# Altium project Custom_ESC.PrjPcb
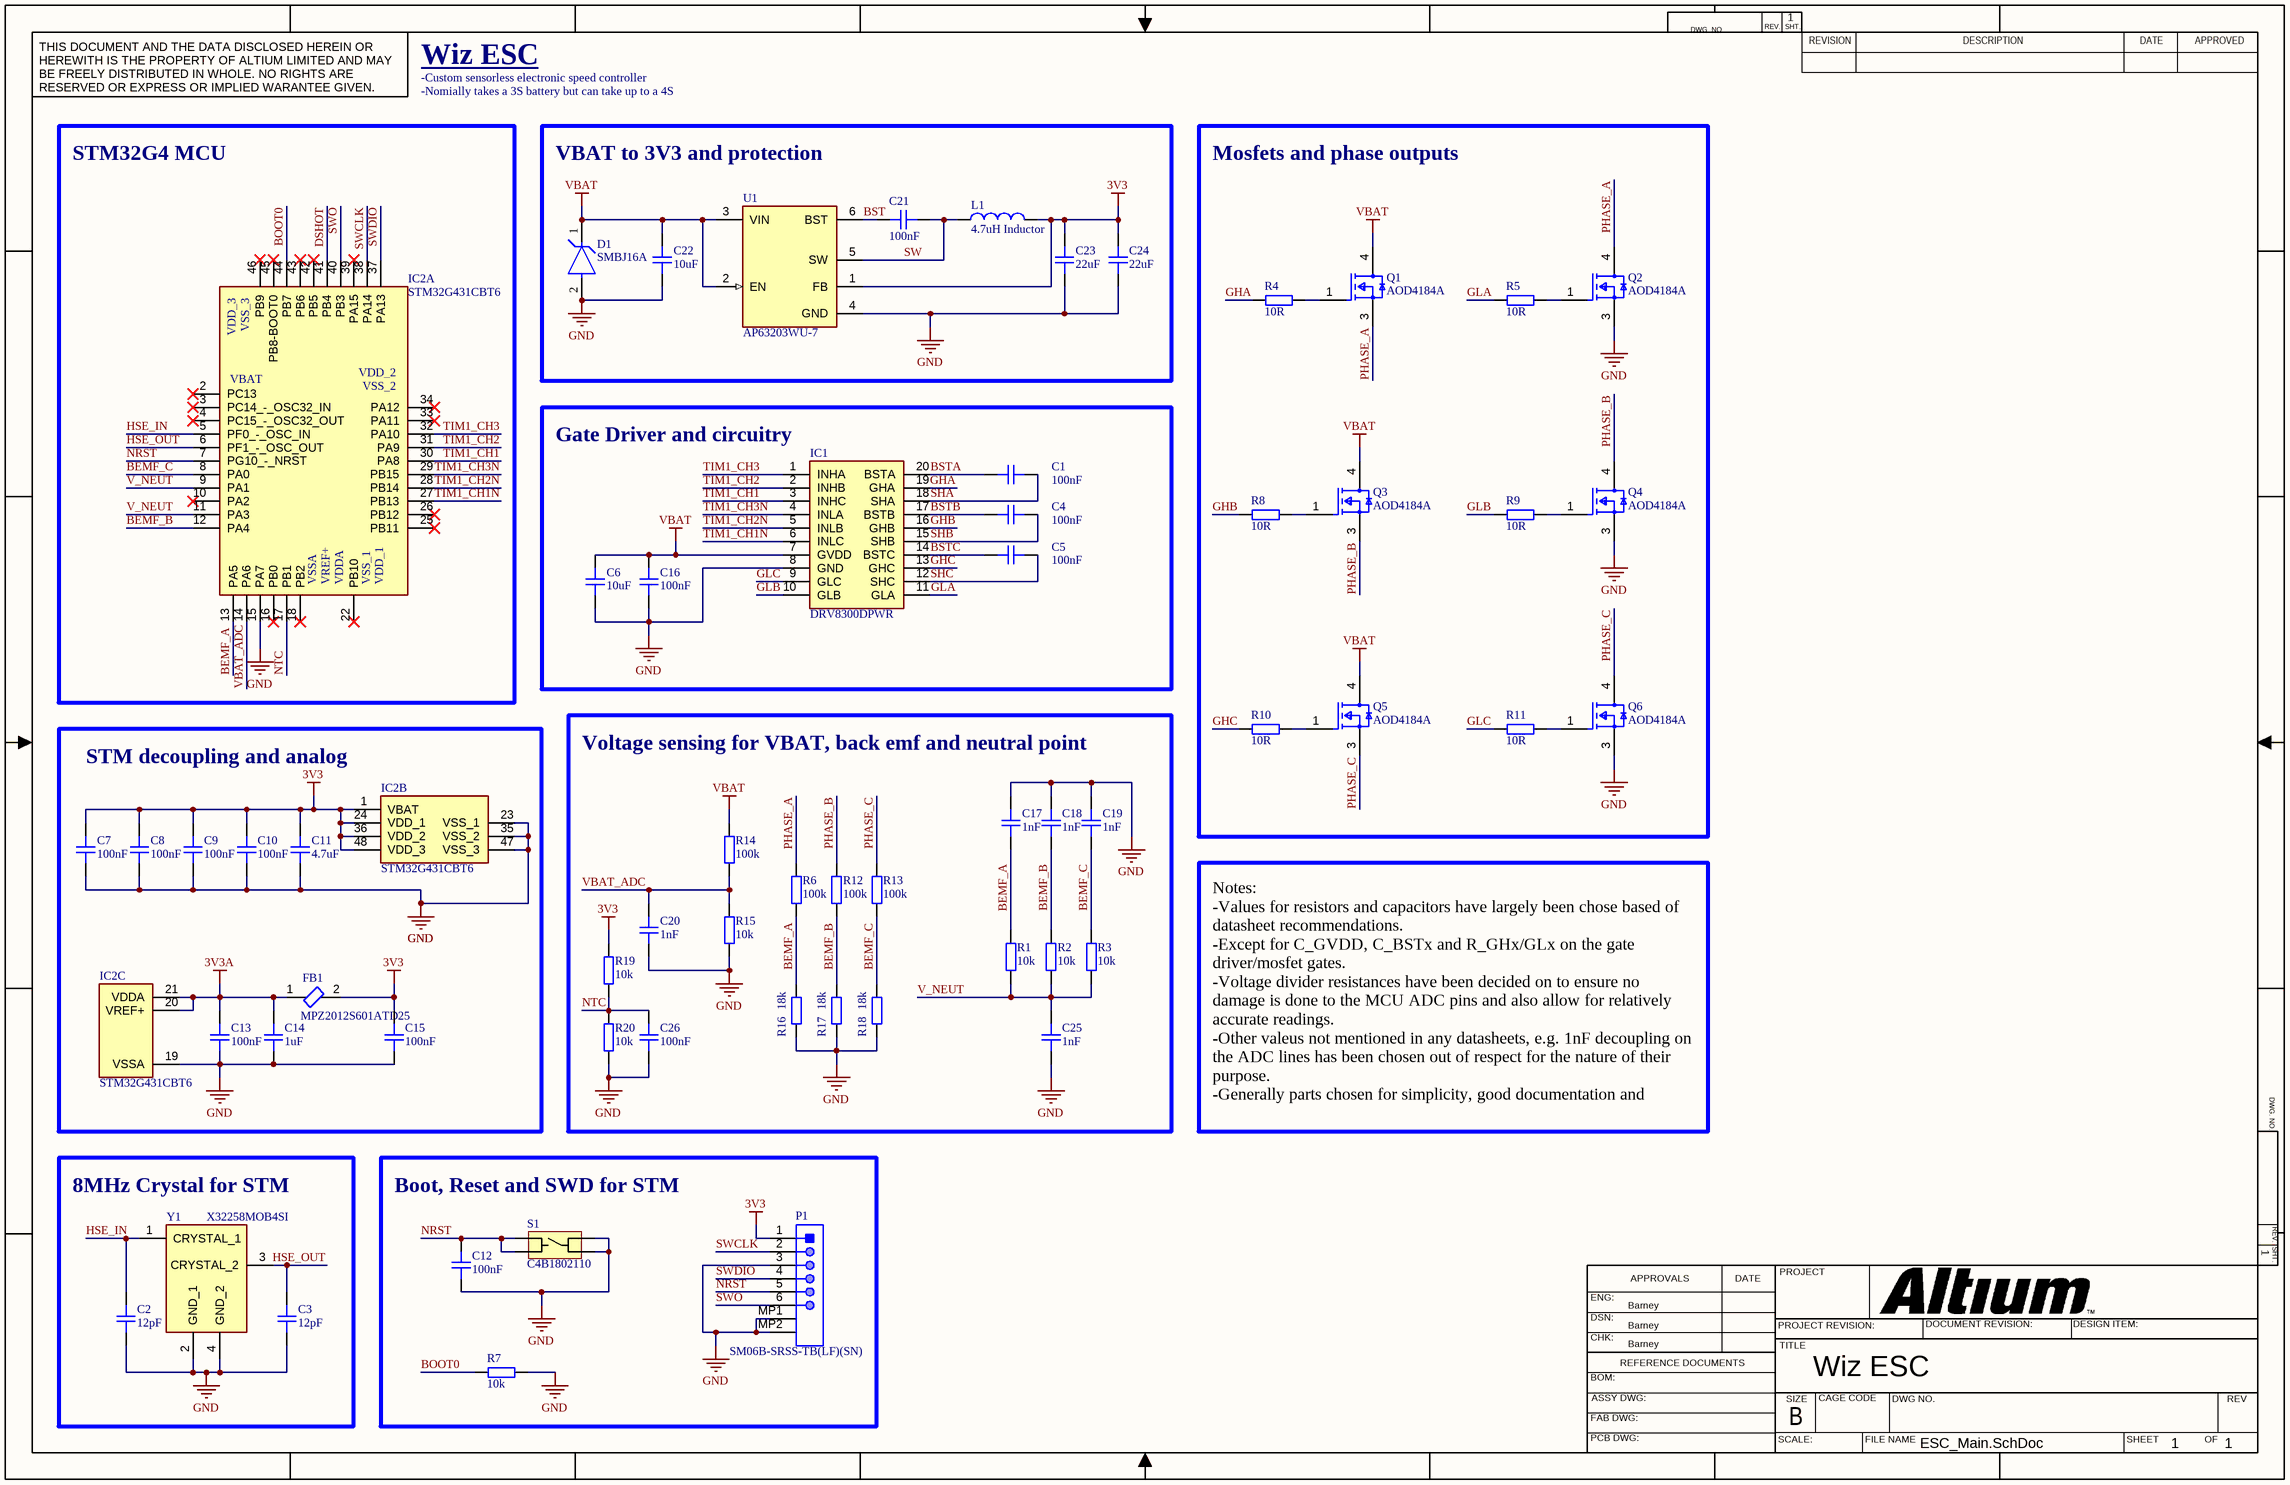
[diagram p0: ESC_Main.SchDoc]
1 sheet, 61 parts. Net scope: global (net labels, ports and power ports of the same name join across sheets).

## Sheet ESC_Main.SchDoc: Wiz ESC
size 431 x 279 mm; Date: 16/7/2026; ApprovedBy: Barney; CheckedBy: Barney; Author: Barney; CompanyName: WizTech; DrawnBy: Barney; Engineer: Barney; Organization: WizTech; DocumentNumber: 1; Revision: 1; SheetNumber: 1; SheetTotal: 1; Time: 21:10; ImagePath: feef; Application_BuildNumber: 1

### Parts
C1  100nF  [CAP_0402]
C2  12pF  [CAP_0402]
C3  12pF  [CAP_0402]
C4  100nF  [CAP_0402]
C5  100nF  [CAP_0402]
C6  10uF  [CAP_1206]
C7  100nF  [CAP_0402]
C8  100nF  [CAP_0402]
C9  100nF  [CAP_0402]
C10  100nF  [CAP_0402]
C11  4.7uF  [CAP_0402]
C12  100nF  [CAP_0402]
C13  100nF  [CAP_0402]
C14  1uF  [CAP_0402]
C15  100nF  [CAP_0402]
C16  100nF  [CAP_0402]
C17  1nF  [CAP_0402]
C18  1nF  [CAP_0402]
C19  1nF  [CAP_0402]
C20  1nF  [CAP_0402]
C21  100nF  [CAP_0402]
C22  10uF  [CAP_1206]
C23  22uF  [CAP_0402]
C24  22uF  [CAP_0402]
C25  1nF  [CAP_0402]
C26  100nF  [CAP_0402]
D1  SMBJ16A  [FP-DO-214AA-MFG]
FB1  MPZ2012S601ATD25  [BEADC2112X105N]
IC1  DRV8300DPWR  [SOP65P640X120-20N]
IC2  STM32G431CBT6  [QFP50P900X900X160-48N]  (parts A,B,C of 3)
L1  4.7uH Inductor  [SMD 8x8 Inductor]
P1  SM06B-SRSS-TB(LF)(SN)  [JST-SM06B-SRSS-TB_V]
Q1  AOD4184A  [FP-TO252-MFG]
Q2  AOD4184A  [FP-TO252-MFG]
Q3  AOD4184A  [FP-TO252-MFG]
Q4  AOD4184A  [FP-TO252-MFG]
Q5  AOD4184A  [FP-TO252-MFG]
Q6  AOD4184A  [FP-TO252-MFG]
R1  10k  [RES_0402]
R2  10k  [RES_0402]
R3  10k  [RES_0402]
R4  10R  [RES_0402]
R5  10R  [RES_0402]
R6  100k  [RES_0603]
R7  10k  [RES_0402]
R8  10R  [RES_0402]
R9  10R  [RES_0402]
R10  10R  [RES_0402]
R11  10R  [RES_0402]
R12  100k  [RES_0603]
R13  100k  [RES_0603]
R14  100k  [RES_0603]
R15  10k  [RES_0603]
R16  18k  [RES_0603]
R17  18k  [RES_0603]
R18  18k  [RES_0603]
R19  10k  [RES_0402]
R20  10k  [RES_0402]
S1  C4B1802110  [SW-SMD_4P-L3.5-W3.0-P1.50-LS4.7]
U1  AP63203WU-7  [FP-TSOT26-MFG]
Y1  X32258MOB4SI  [X32258MOB4SI]

### Blocks framed on the sheet
STM32G4 MCU: IC2
VBAT to 3V3 and protection: C21-C24 D1 L1 U1
Mosfets and phase outputs: Q1-Q6 R4 R5 R8-R11
Gate Driver and circuitry: C1 C4-C6 C16 IC1
STM decoupling and analog: C7-C11 C13-C15 FB1 IC2
Voltage sensing for VBAT, back emf and neutral point: C17-C20 C25 C26 R1-R3 R6 R12-R20
8MHz Crystal for STM: C2 C3 Y1
Boot, Reset and SWD for STM: C12 P1 R7 S1

### Nets
3V3: C7.1 C8.1 C9.1 C10.1 C11.1 C15.1 C23.2 C24.2 FB1.2 IC2.1(VBAT) IC2.24(VDD_1) IC2.36(VDD_2) IC2.48(VDD_3) L1.2 P1.1 R19.2 U1.1(FB)
3V3A: C13.1 C14.2 FB1.1 IC2.20(VREF+) IC2.21(VDDA)
GND: C2.2 C3.2 C6.1 C7.2 C8.2 C9.2 C10.2 C11.2 C12.2 C13.2 C14.1 C15.2 C16.1 C17.1 C18.1 C19.1 C20.2 C22.1 C23.1 C24.1 C25.2 C26.1 D1.2(A) IC1.8(GND) IC2.15(PA7) IC2.19(VSSA) IC2.23(VSS_1) IC2.35(VSS_2) IC2.47(VSS_3) P1.3 P1.MP1 P1.MP2 Q2.3(S) Q4.3(S) Q6.3(S) R7.2 R15.1 R16.1 R17.1 R18.1 R20.1 S1.3 S1.4 U1.4(GND) Y1.2(GND_1) Y1.4(GND_2)
VBAT: C6.2 C16.2 C22.2 D1.1(C) IC1.7(GVDD) Q1.4(D) Q3.4(D) Q5.4(D) R14.2 U1.2(EN) U1.3(VIN)
BEMF_A: C17.2 IC2.13(PA5) R1.2 R6.1 R16.2
BEMF_B: C18.2 IC2.12(PA4) R2.2 R12.1 R17.2
BEMF_C: C19.2 IC2.8(PA0) R3.2 R13.1 R18.2
BOOT0: IC2.44(PB7) R7.1
BST: C21.2 U1.6(BST)
BSTA: C1.2 IC1.20(BSTA)
BSTB: C4.2 IC1.17(BSTB)
BSTC: C5.2 IC1.14(BSTC)
DSHOT: IC2.41(PB4)
GHA: IC1.19(GHA) R4.1
GHB: IC1.16(GHB) R8.1
GHC: IC1.13(GHC) R10.1
GLA: IC1.11(GLA) R5.1
GLB: IC1.10(GLB) R9.1
GLC: IC1.9(GLC) R11.1
HSE_IN: C2.1 IC2.5(PF0_-_OSC_IN) Y1.1(CRYSTAL_1)
HSE_OUT: C3.1 IC2.6(PF1_-_OSC_OUT) Y1.3(CRYSTAL_2)
NRST: C12.1 IC2.7(PG10_-_NRST) P1.5 S1.1 S1.2
NTC: C26.2 IC2.17(PB1) R19.1 R20.2
PHASE_A: Q1.3(S) Q2.4(D) R6.2
PHASE_B: Q3.3(S) Q4.4(D) R12.2
PHASE_C: Q5.3(S) Q6.4(D) R13.2
SHA: C1.1 IC1.18(SHA)
SHB: C4.1 IC1.15(SHB)
SHC: C5.1 IC1.12(SHC)
SW: C21.1 L1.1 U1.5(SW)
SWCLK: IC2.38(PA14) P1.2
SWDIO: IC2.37(PA13) P1.4
SWO: IC2.40(PB3) P1.6
TIM1_CH1: IC1.3(INHC) IC2.30(PA8)
TIM1_CH1N: IC1.6(INLC) IC2.27(PB13)
TIM1_CH2: IC1.2(INHB) IC2.31(PA9)
TIM1_CH2N: IC1.5(INLB) IC2.28(PB14)
TIM1_CH3: IC1.1(INHA) IC2.32(PA10)
TIM1_CH3N: IC1.4(INLA) IC2.29(PB15)
V_NEUT: C25.1 IC2.9(PA1) IC2.11(PA3) R1.1 R2.1 R3.1
VBAT_ADC: C20.1 IC2.14(PA6) R14.1 R15.2
NetQ1_1: Q1.1(G) R4.2
NetQ2_1: Q2.1(G) R5.2
NetQ3_1: Q3.1(G) R8.2
NetQ4_1: Q4.1(G) R9.2
NetQ5_1: Q5.1(G) R10.2
NetQ6_1: Q6.1(G) R11.2

Not connected (* = marked no-connect by the designer): IC2 2(PC13)* 3(PC14_-_OSC32_IN)* 4(PC15_-_OSC32_OUT)* 10(PA2)* 16(PB0)* 18(PB2)* 22(PB10)* 25(PB11)* 26(PB12)* 33(PA11)* 34(PA12)* 39(PA15)* 42(PB5)* 43(PB6)* 45(PB8-BOOT0)* 46(PB9)*

### Notes on the sheet
- Wiz ESC
- -Custom sensorless electronic speed controller
- -Nomially takes a 3S battery but can take up to a 4S
- Notes:
  -Values for resistors and capacitors have largely been chose based of datasheet recommendations.
  -Except for C_GVDD, C_BSTx and R_GHx/GLx on the gate driver/mosfet gates.
  -Voltage divider resistances have been decided on to ensure no damage is done to the MCU ADC pins and also allow for relatively accurate readings.
  -Other valeus not mentioned in any datasheets, e.g. 1nF decoupling on the ADC lines has been chosen out of respect for the nature of their purpose.
  -Generally parts chosen for simplicity, good documentation and overall fitting the needs.
- DWG. NO.
- REV.
- SHT.
- THIS DOCUMENT AND THE DATA DISCLOSED HEREIN OR HEREWITH IS THE PROPERTY OF ALTIUM LIMITED AND MAY BE FREELY DISTRIBUTED IN WHOLE. NO RIGHTS ARE RESERVED OR EXPRESS OR IMPLIED WARANTEE GIVEN.
- REVISION
- DESCRIPTION
- DATE
- APPROVED
- ENG:
- APPROVALS
- PROJECT
- DSN:
- CHK:
- REFERENCE DOCUMENTS
- PROJECT REVISION:
- TITLE
- DOCUMENT REVISION:
- DESIGN ITEM:
- BOM:
- FAB DWG:
- PCB DWG:
- ASSY DWG:
- SCALE:
- SIZE
- B
- CAGE CODE
- FILE NAME
- DWG NO.
- SHEET
- OF
- REV

### Library data of the parts
C1 C4 C5 C16 C21 C26 = CAP_0402: Capacitor SMD 0402; Manufacturer: Samsung Electro-Mechanics; Manufacturer Part Number: CL05B104KB5NNNC; Rating: 50V X7R; Distributor Link: *; LCSC: C960916; Dielectric: *
C2 C3 = CAP_0402: Capacitor SMD 0402; Manufacturer: Samsung Electro-Mechanics; Manufacturer Part Number: CL05C120JB5NNNC; Rating: 50V C0G; Distributor Link: *; LCSC: C26406; Dielectric: *
C6 C22 = CAP_1206: Capacitor SMD 1206; Manufacturer: Samsung Electro-Mechanics; Manufacturer Part Number: CL31Y106KBKVPNE; Rating: X7S; Distributor Link: *; LCSC: C2803389; Dielectric: *
C7-C10 C12 C13 C15 = CAP_0402: Capacitor SMD 0402; Manufacturer: Samsung Electro-Mechanics; Manufacturer Part Number: CL05A104KA5NNNC; Rating: 25V X5R; Distributor Link: *; LCSC: C100072; Dielectric: *
C11 = CAP_0402: Capacitor SMD 0402; Manufacturer: Samsung Electro-Mechanics; Manufacturer Part Number: CL05A475KP5NRNC; Rating: 10V X5R; Distributor Link: *; LCSC: C368809; Dielectric: *
C14 = CAP_0402: Capacitor SMD 0402; Manufacturer: Samsung Electro-Mechanics; Manufacturer Part Number: CL05A105KA5NQNC; Rating: 25V X5R; Distributor Link: *; LCSC: C52923; Dielectric: *
C17-C20 C25 = CAP_0402: Capacitor SMD 0402; Manufacturer: Samsung Electro-Mechanics; Manufacturer Part Number: CL05B102KB5NNNC; Rating: 50V X7R; Distributor Link: *; LCSC: C14442; Dielectric: *
C23 C24 = CAP_0402: Capacitor SMD 0402; Manufacturer: Samsung Electro-Mechanics; Manufacturer Part Number: CL10A226MO7JZNC; Rating: 16V X5R; Distributor Link: *; LCSC: C2762594; Dielectric: *
D1 = CMP-06396-000105-1: TVS DIODE 16VWM 26VC SMBJ; Manufacturer: Jingdao Microelectronics; RoHS Compliant: Yes; Manufacturer Part Number: SMBJ16A; LCSC: C353386
FB1 = GZ2012D601TF: Ferrite Beads 600 @ 100MHz 0805; Manufacturer: TDK; Manufacturer Part Number: MPZ2012S601ATD25; LCSC: C81034
IC1 = DRV8300DPWR: Integrated Circuit; Manufacturer: Texas Instruments; Datasheet Link: https://www.lcsc.com/datasheet/C3036056.pdf?spm=wm.sxq.inf.ggs___wm.fly.bg.0.stp&lcsc_vid=QARbBFEHQlJdVgUDE1RXVwJVT1cLBFdUTlQPUwFSQ1UxVlNeQ1NfX1JVQldXUDsOAxUeFF5JWBYZEEoKFBINSQcJGk4MFQUIE0wKAhAHHg1BVlRfWQkaCgg%3D; Height: 1.2mm; Manufacturer Part Number: DRV8300DPWR; Mouser Part Number: 595-DRV8300DPWR; Mouser Price/Stock: https://www.mouser.co.uk/ProductDetail/Texas-Instruments/DRV8300DPWR?qs=eP2BKZSCXI6qJbKdYnGwBg%3D%3D; Arrow Part Number: DRV8300DPWR; Arrow Price/Stock: https://www.arrow.com/en/products/drv8300dpwr/texas-instruments?utm_currency=USD&region=nac; LCSC: C3036056
IC2 = STM32G474CBT6: Integrated Circuit; Manufacturer: STMicroelectronics; Manufacturer Part Number: STM32G431CBT6TR; Datasheet Link: https://www.st.com/resource/en/datasheet/stm32g474cb.pdf; Height: 1.6mm; Mouser Part Number: 511-STM32G431CBT6TR; Mouser Price/Stock: https://www.mouser.co.uk/ProductDetail/STMicroelectronics/STM32G474CBT6TR?qs=sPbYRqrBIVmx65Oml6enIQ%3D%3D; Arrow Part Number: STM32G431CBT6TR; Arrow Price/Stock: https://www.arrow.com/en/products/stm32g474cbt6tr/stmicroelectronics.html?utm_currency=USD&region=nac; LCSC: C529355
L1 = SMNR8040-4R7MT: 5.9A 4.7uH 5.9A 24mΩ Magnetic Shielded Inductor ±20% SMD,8x8mm Fixed Inductors RoHS; Manufacturer: Shun Xiang Nuo; Manufacturer Part Number: SMNR8040-4R7MT; LCSC: C266436
P1 = CMP-2000-07080-1: Male Header, Pitch 1 mm, 1 x 6 Position, Height 2.95 mm, -25 to 85 degC, RoHS, Tape and Reel; Manufacturer: JST; No of Positions: 6; Pitch: 1mm; Style/Orientation: RightAngleHeader/Plug; Datasheet URL: https://datasheet.ciiva.com/26894/getdatasheetpartid-708885-26894671.pdf; Package Description: Male Header, Pitch 1 mm, 1 X 6 Position, Height 2.9 mm; Termination: Solder; Manufacturer URL: http://www.jst.com/home2.html; Type: ShroudedHeader; Package Reference: SM06B-SRSS-TB; Datasheet Version: 11/2010; Mounting Technology: SurfaceMount; Manufacturer Part Number: SM06B-SRSS-TB(LF)(SN); LCSC: C160405
Q1-Q4 Q6 = CMP-83955-000007-1: MOSFET N-CH 40V 50A TO252; Power Dissipation: 50W; Rds On Max: 7mR; Input Capacitance: 1.8nF; Gate to Source Voltage (Vgs): 20V; Number of Elements: 1; Max Power Dissipation: 2.3W; Min Operating Temperature: -55°C; Drain to Source Voltage (Vdss): 40V; Max Operating Temperature: 175°C; Case/Package: DPAK; Mount: Surface Mount; Continuous Drain Current (ID): 50A; Packaging: Cut Tape; Number of Pins: 3; Radiation Hardening: No
Q5 = CMP-83955-000007-1: MOSFET N-CH 40V 50A TO252; Manufacturer: AOS; Power Dissipation: 50W; Rds On Max: 7mR; Input Capacitance: 1.8nF; Gate to Source Voltage (Vgs): 20V; Number of Elements: 1; Max Power Dissipation: 2.3W; Min Operating Temperature: -55°C; Drain to Source Voltage (Vdss): 40V; Max Operating Temperature: 175°C; Case/Package: DPAK; Mount: Surface Mount; Continuous Drain Current (ID): 50A; Packaging: Cut Tape; Number of Pins: 3; Manufacturer Part Number: AOD4184A; LCSC: C99124
R1-R3 R7 R19 R20 = RES_0402: Resistor SMD 0402; Manufacturer: FOJAN; Manufacturer Part Number: FRC0402F1002TS; Distributor Link: *; LCSC: C2906861
R4 R5 R8-R11 = RES_0402: Resistor SMD 0402; Manufacturer: FOJAN; Manufacturer Part Number: FRC0402F10R0TS; Distributor Link: *; LCSC: C2906862
R6 R12-R14 = RES_0603: Resistor SMD 0603; Manufacturer: FOJAN; Manufacturer Part Number: FRC0603J104 TS; Distributor Link: *; LCSC: C2907088
R15 = RES_0603: Resistor SMD 0603; Manufacturer: FOJAN; Manufacturer Part Number: FRC0603F1002TS; Distributor Link: *; LCSC: C2906982
R16-R18 = RES_0603: Resistor SMD 0603; Manufacturer: FOJAN; Manufacturer Part Number: FRC0603F1802TS; Distributor Link: *; LCSC: C2907001
S1 = C4B1802110: SMD NO Push Button Switch; Manufacturer: SAMZO; Manufacturer Part Number: C4B1802110; LCSC: C49393608
U1 = CMP-12757-000006-1: IC REG BUCK 3.3V 2A TSOT26; Manufacturer: Diodes Inc.; Output Type: Fixed; Min Supply Voltage: 3.8V; Number Of Outputs: 1; Max Junction Temp: +160°C; Nominal Supply Current: 22uA; Standoff Height: 0.01mm; Switching Frequency: 1.1MHz; Max Supply Voltage: 32V; ComponentLink2Description: Datasheet; Device Class L1: Integrated Circuits (ICs); Temperature: to +160°C; Device Class L3: Voltage Regulators - Switching; RoHS: TRUE; Octopart: https://octopart.com/ap63203wu-7-diodes+inc.-98099550; Output Voltage: 3.3V; Lead Free: Yes; ComponentLink2URL: https://www.diodes.com/assets/Datasheets/AP63200-AP63201-AP63203-AP63205.pdf; Digikey Description: IC REG BUCK 3.3V 2A TSOT26; Footprint Url: https://www.diodes.com/assets/Package-Files/TSOT26.pdf; Ambient Temperature Range High: +85°C; Height: 1mm; Automotive: No; Temperature Range High: +160°C; Switching Topology: Buck; Output Current: 2A; Package: TSOT26; Category: IC; Mouser Description: AP63203 Series 3.3 V 2 A SMT Fixed Low IQ Synchronous Buck - TSOT-26; Device Class L2: Power Management ICs; Ambient Temperature Range Low: -40°C; Manufacturer Part Number: AP63203WU-7; LCSC: C780769
Y1 = X32258MOB4SI: Crystal or Oscillator; Manufacturer: YXC; Datasheet Link: https://item.szlcsc.com/datasheet/X32258MOB4SI/2777872.html; Height: 0.8mm; Manufacturer Part Number: X32258MOB4SI; ComponentLink1Description: New link; ComponentLink1URL: *; LCSC: C2682775